# Altium schematic sheet 1_Demo_Footprint.SchDoc
size A4; SheetNumber: 1; SheetTotal: 1
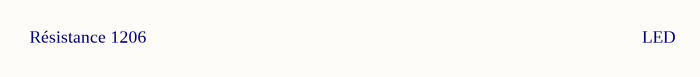
[diagram p0: 1_Demo_Footprint.SchDoc]

## Notes on the sheet
- Résistance 1206
- LED